# EAGLE design PDM_v1 (EAGLE 7.1.0)
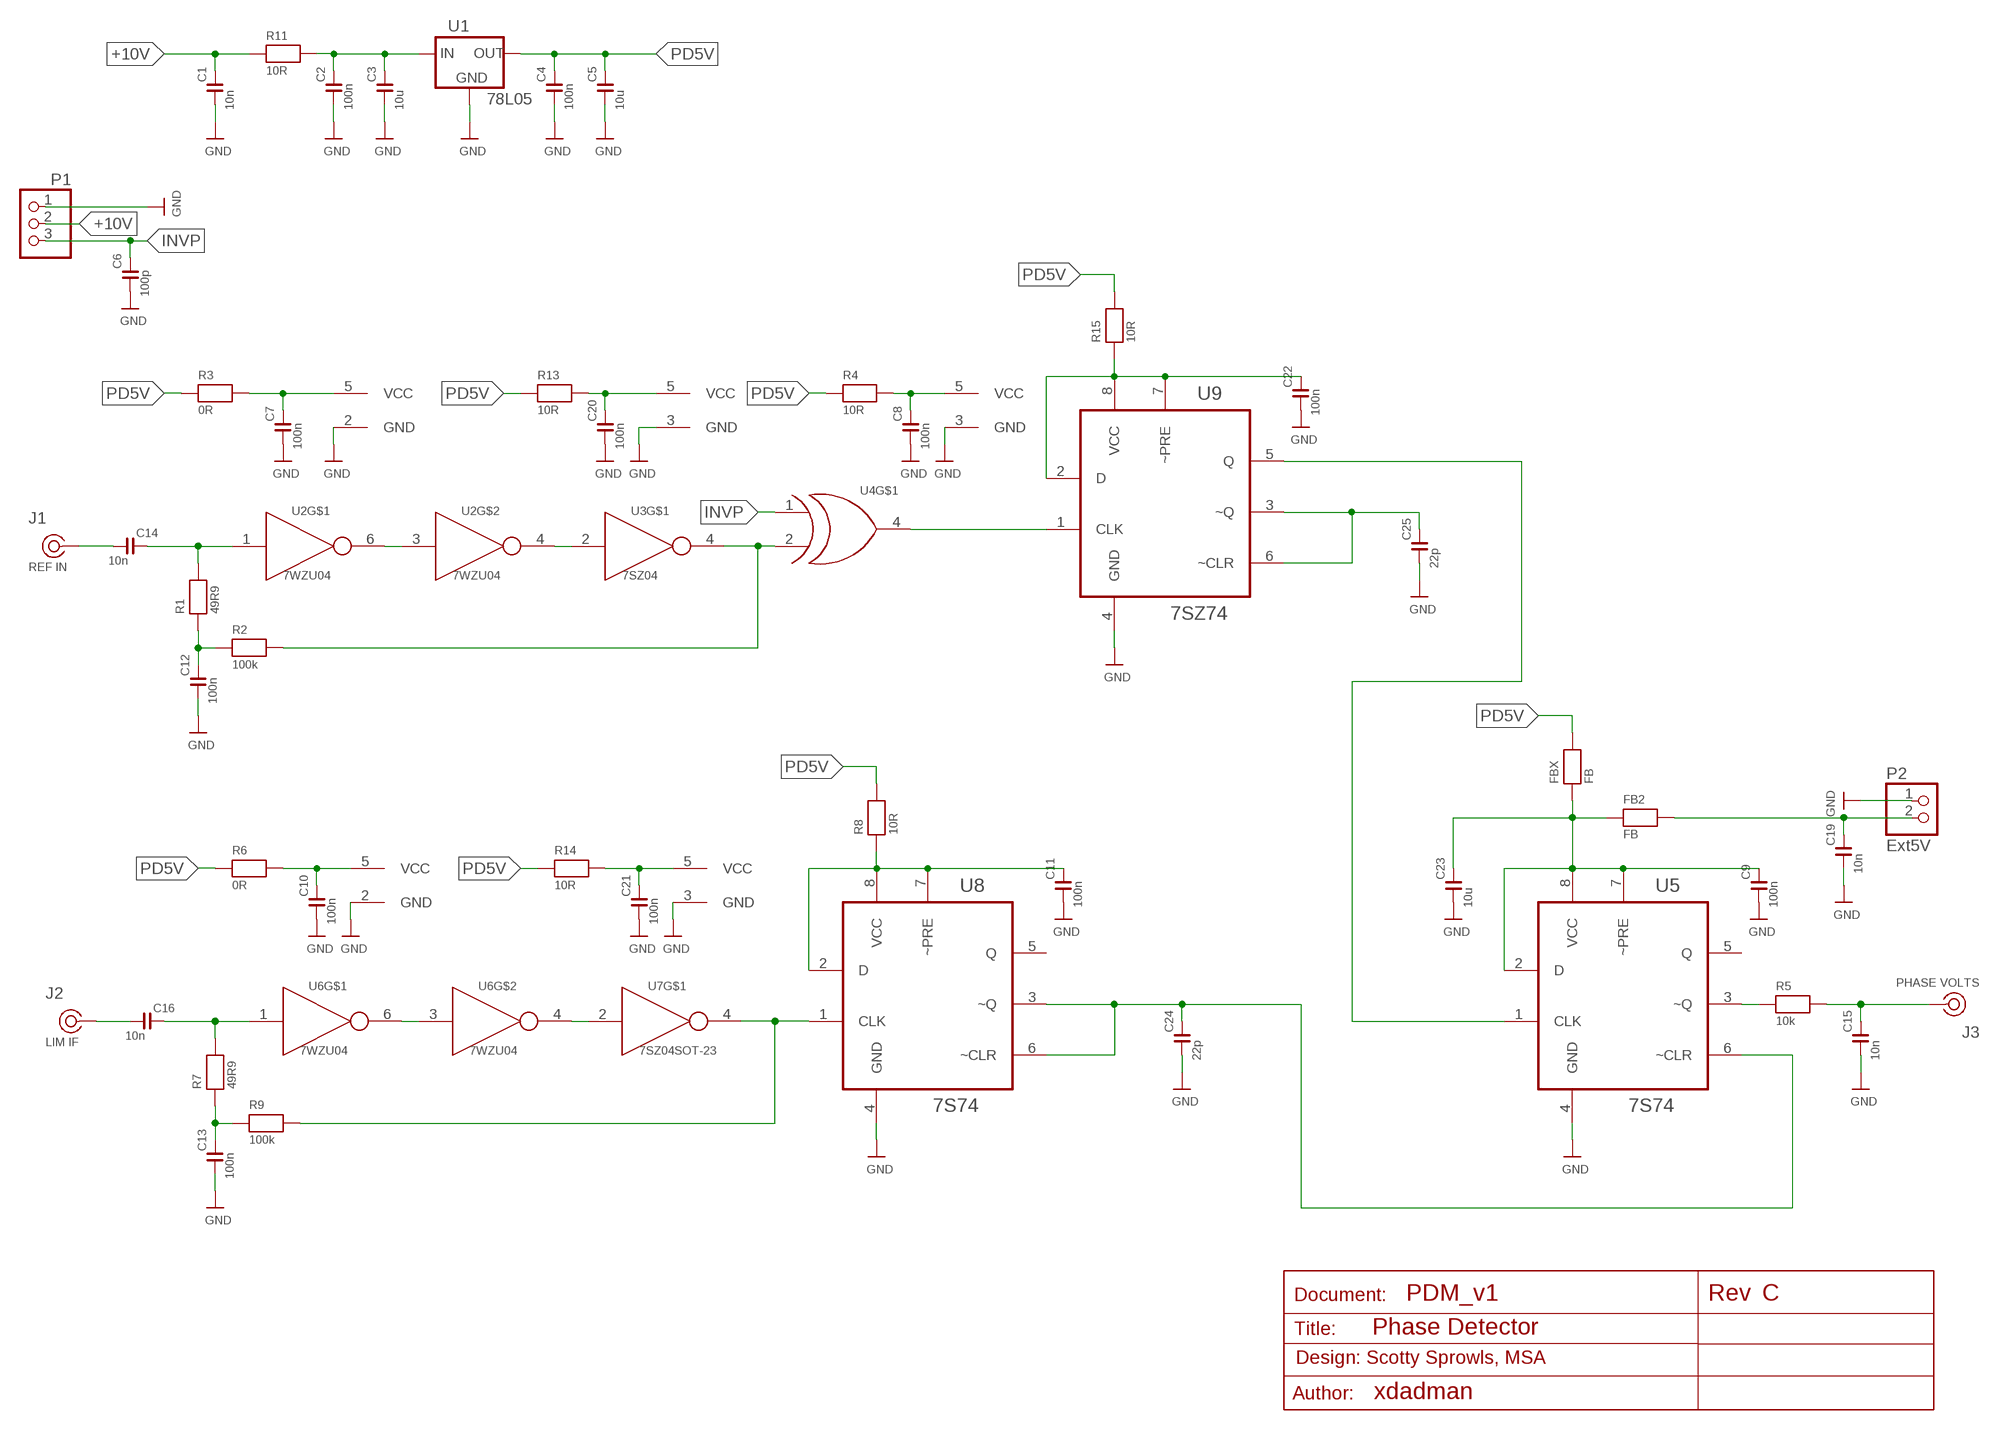
[diagram p0: schematic, sheet 1]

## Parts
C1  10n  C080510N  [C0805]
C2  100n  C0805100N  [C0805]
C3  10u  CC120610U  [C1206]
C4  100n  C0805100N  [C0805]
C5  10u  CC120610U  [C1206]
C6  100p  C0805100P  [C0805]
C7  100n  C0805100N  [C0805]
C8  100n  C0805100N  [C0805]
C9  100n  C0805100N  [C0805]
C10  100n  C0805100N  [C0805]
C11  100n  C0805100N  [C0805]
C12  100n  C0805100N  [C0805]
C13  100n  C0805100N  [C0805]
C14  10n  C080510N  [C0805]
C15  10n  C080510N  [C0805]
C16  10n  C080510N  [C0805]
C19  10n  C080510N  [C0805]
C20  100n  C0805100N  [C0805]
C21  100n  C0805100N  [C0805]
C22  100n  C0805100N  [C0805]
C23  10u  CC120610U  [C1206]
C24  22p  CC060322P  [C0603]
C25  22p  CC060322P  [C0603]
FB2  FB  R0805FB045  [R0805]
FBX  FB  R0805FB045  [R0805]
J1  REF IN  COAX  [SLIM_COAX_PAD]
J2  LIM IF  COAX  [SLIM_COAX_PAD]
J3  PHASE VOLTS  COAX  [SLIM_COAX_PAD]
P1  PINHD-1X3  [1X03]
P2  Ext5V  PINHD-1X2  [1X02]
R1  49R9  R080549R9  [R0805]
R2  100k  R0805100K  [R0805]
R3  0R  R08050R  [R0805]
R4  10R  R080510R  [R0805]
R5  10k  R080510K  [R0805]
R6  0R  R08050R  [R0805]
R7  49R9  R080549R9  [R0805]
R8  10R  R080510R  [R0805]
R9  100k  R0805100K  [R0805]
R11  10R  R080510R  [R0805]
R13  10R  R080510R  [R0805]
R14  10R  R080510R  [R0805]
R15  10R  R080510R  [R0805]
U1  78L05  78MXXL78L05  [SOT89]
U2  7WZU04  [SC70-6L]
U3  7SZ04  7SZ04SOT-23  [SOT23-5L]
U4  74LVC1G86  [SOT23-5L]
U5  7S74  SN74LVC2G74DCUR  [SOP50P310X90-8N]
U6  7WZU04  [SC70-6L]
U7  7SZ04SOT-23  [SOT23-5L]
U8  7S74  SN74LVC2G74DCUR  [SOP50P310X90-8N]
U9  7SZ74  SN74LVC2G74DCUR  [SOP50P310X90-8N]

## Nets
+10V: C1.2 P1.2 R11.1
GND: C1.1 C2.1 C3.1 C4.1 C5.1 C6.1 C7.1 C8.1 C9.1 C10.1 C11.1 C12.1 C13.1 C15.1 C19.1 C20.1 C21.1 C22.1 C23.1 C24.1 C25.1 P1.1 P2.1 U1.2(GND) U1.4(GND) U2.2(GND) U3.3(GND) U4.3(GND) U5.4(GND) U6.2(GND) U7.3(GND) U8.4(GND) U9.4(GND)
INVP: C6.2 P1.3 U4.1(A)
N$1: C2.2 C3.2 R11.2 U1.3(IN)
N$2: C14.2 R1.2 U2.1(IN)
N$3: C12.2 R1.1 R2.1
N$4: U2.3(IN) U2.6(OUT)
N$5: R2.2 U3.4(OUT) U4.2(B)
N$6: C20.2 R13.2 U3.5(VCC)
N$7: U2.4(OUT) U3.2(IN)
N$8: C8.2 R4.2 U4.5(VCC)
N$9: U4.4(Y) U9.1(CLK)
N$10: C22.2 R15.1 U9.2(D) U9.7(~PRE) U9.8(VCC)
N$11: C25.2 U9.3(~Q) U9.6(~CLR)
N$12: C16.2 R7.2 U6.1(IN)
N$13: C13.2 R7.1 R9.1
N$14: U6.3(IN) U6.6(OUT)
N$15: R9.2 U7.4(OUT) U8.1(CLK)
N$16: C21.2 R14.2 U7.5(VCC)
N$17: U6.4(OUT) U7.2(IN)
N$18: C10.2 R6.2 U6.5(VCC)
N$19: C11.2 R8.1 U8.2(D) U8.7(~PRE) U8.8(VCC)
N$20: C24.2 U5.6(~CLR) U8.3(~Q) U8.6(~CLR)
N$21: U5.1(CLK) U9.5(Q)
N$22: C9.2 C23.2 FB2.1 FBX.1 U5.2(D) U5.7(~PRE) U5.8(VCC)
N$23: C15.2 J3.SIG R5.2
N$24: C14.1 J1.SIG
N$25: C7.2 R3.2 U2.5(VCC)
N$26: C16.1 J2.SIG
N$27: R5.1 U5.3(~Q)
P2: C19.2 FB2.2 P2.2
PD5V: C4.2 C5.2 FBX.2 R3.1 R4.1 R6.1 R8.2 R13.1 R14.1 R15.2 U1.1(OUT)
Unconnected: U5.5(Q) U8.5(Q)

## Notes on the sheet
- C
- Phase Detector
- Design: Scotty Sprowls, MSA
- xdadman

## Power pins joined to a net without a drawn wire
GND: J1.GND J2.GND J3.GND

## Library data of the parts
C1 C14-C16 C19 = MSA_lib:C0805: Ceramic capacitor; OC_FARNELL: 1414662
C2 C4 C7-C13 C20-C22 = MSA_lib:C0805: Ceramic capacitor; OC_FARNELL: 1759166
C3 C5 C23 = MSA_lib:CC1206: Capacitor ceramic 1206; OC_FARNELL: 1611967
C6 = MSA_lib:C0805: Ceramic capacitor; OC_FARNELL: 1414656
C24 C25 = MSA_lib:CC0603: 0603 Ceramic capacitor; OC_FARNELL: 8819831
FB2 FBX = MSA_lib:R0805: Resistors; OC_FARNELL: 1515661
J1-J3 = MSA_lib:COAX
P1 = MSA_lib:PINHD-1X3: PIN HEADER
P2 = MSA_lib:PINHD-1X2: PIN HEADER
R1 R7 = MSA_lib:R0805: Resistors; OC_FARNELL: 2312274
R2 R9 = MSA_lib:R0805: Resistors; OC_FARNELL: 2332098
R3 R6 = MSA_lib:R0805: Resistors; OC_FARNELL: 2057661
R4 R8 R11 R13-R15 = MSA_lib:R0805: Resistors; OC_FARNELL: 2332043
R5 = MSA_lib:R0805: Resistors; OC_FARNELL: 2073607
U1 = MSA_lib:78MXXL: VOLTAGE REGULATOR; OC_FARNELL: 1366573
U2 U6 = MSA_lib:7WZU04; OC_FARNELL: 1467353
U3 U7 = MSA_lib:7SZ04; OC_FARNELL: 1417667
U4 = MSA_lib:74LVC1G86; OC_FARNELL: 1741239
U5 U8 U9 = MSA_lib:SN74LVC2G74DCUR: POSITIVE-EDGE-TRIGGERED D-FLIP-FLOP; MPN: SN74LVC2G74DCUR; OC_FARNELL: 1287633; OC_NEWARK: 76C4223; PACKAGE: VSSOP-8; SUPPLIER: Texas Instruments

## Net classes
1 50OHM: clearance 0.508 mm

## Board

Size 32 x 32 mm. Coordinates in mm from the lower left corner, seen from the top.
Outline: 0,0 32,0 32,32 0,32 0,0
Copper layers (1*16): Top 0.035mm / dielectric 1.5mm / Bottom 0.035mm
Design rules "kuba_no_CLR *": minimum track width 8mil, minimum drill 15mil, track to track 8mil, track to pad 8mil, pad to pad 8mil, via to via 8mil, smd to smd 8mil, copper to edge 0mil, drill to drill 8mil, minimum pad ring 12mil, minimum via ring 10mil, stop-mask expansion 4mil, vias tented up to drill 0mil, thermal gap 10mil

### Footprints (pad centres in the part's own frame; a part is rotated, then mirrored left to right if it is on the bottom)
C0805 = smd 1.2 x 1.5: 1 -0.953,0; 2 0.953,0
C1206 = smd 1.6 x 1.8: 1 -1.4,0; 2 1.4,0
C0603 = smd 0.9 x 1.1: 1 -0.794,0; 2 0.794,0
R0805 = smd 1.3 x 1.5: 1 -0.95,0; 2 0.95,0
SLIM_COAX_PAD = smd 1.27 x 0.635 bottom: GND 0,-2.667 | drill 1.1: SIG 0,0
1X03 = drill 1.016: 1 -2.54,0; 2 0,0; 3 2.54,0
1X02 = drill 1.016: 1 -1.27,0; 2 1.27,0
SOT89 = smd 1.2 x 1.5: 1 -1.6,-2; 3 1.6,-2 | smd 1 x 1.5: 2 0,-2 | smd 2.4 x 3: 4 0,1.25
SC70-6L = smd 0.35 x 0.8: 1 -0.65,-0.85; 2 0,-0.85; 3 0.65,-0.85; 4 0.65,0.85; 5 0,0.85; 6 -0.65,0.85
SOT23-5L = smd 0.55 x 1.2: 1 -0.95,-1.3; 2 0,-1.3; 3 0.95,-1.3; 4 0.95,1.3; 5 -0.95,1.3
SOP50P310X90-8N = smd 1.067 x 0.254: 1 -1.422,0.762; 2 -1.422,0.254; 3 -1.422,-0.254; 4 -1.422,-0.762; 5 1.422,-0.762; 6 1.422,-0.254; 7 1.422,0.254; 8 1.422,0.762

### Placement (x,y rotation side)
C1  19.56,14.48 270 top
C2  13.97,15.75 270 top
C3  11.94,14.73 270 top
C4  3.05,16.51 0 top
C5  3.56,18.54 0 top
C6  19.18,10.41 180 top
C7  10.67,7.87 0 top
C8  19.56,6.1 0 top
C9  21.08,20.57 90 top
C10  10.41,25.4 90 top
C11  20.57,28.19 180 top
C12  6.1,4.83 270 top
C13  12.95,21.59 270 top
C14  4.57,8.64 180 top
C15  25.4,17.53 270 top
C16  7.87,22.35 0 top
C19  28.45,28.7 180 top
C20  15.24,7.11 0 top
C21  16.51,27.18 0 top
C22  25.4,3.3 90 top
C23  27.94,22.86 180 top
C24  23.11,26.67 270 top
C25  27.69,3.3 90 top
FB2  24.89,25.65 90 top
FBX  19.3,20.57 270 top
J1  6.6,8.64 180 top
J2  6.86,23.62 180 top
J3  24.89,15.49 0 top
P1  17.27,12.95 270 top
P2  27.94,26.67 180 top
R1  4.06,5.59 90 top
R2  10.16,3.3 0 top
R3  10.67,9.65 0 top
R4  22.61,9.14 270 top
R5  23.62,17.53 270 top
R6  9.4,28.19 0 top
R7  11.18,21.59 90 top
R8  16.51,20.32 180 top
R9  16,22.1 0 top
R11  15.49,12.95 180 top
R13  14.48,9.65 0 top
R14  16.51,28.96 0 top
R15  24.38,11.43 90 top
U1  7.87,14.99 270 top
U2  9.4,5.59 270 top
U3  14.48,4.57 270 top
U4  19.81,3.56 270 top
U5  23.11,21.59 90 top
U6  12.7,24.89 0 top
U7  16.51,24.64 270 top
U8  20.07,25.15 90 top
U9  24.89,7.62 90 top

### Tracks (layer width: path | path; a pad name or v marks a point on that pad's centre or on a via)
+10V
  Top 0.813: R11.1 P1.2 18.99,12.95 C1.2
GND  (via drill 0.5)
  Top 0.305: 13.18,3.53 U3.3 12.77,3.62 12.7,3.56 v12.57,3.56 | v6.86,5.59 6.29,5.59 C12.1 | U1.2 v5.08,14.99 | C13.1 12.7,22.8 U6.2 12.7,23.11 v13.21,22.61 | C24.1 22.38,28.19 v22.1,28.19 C11.1 | C22.1 25.4,1.27 27.69,1.27 C25.1 | U4.3 17.46,2.61 v17.14,2.92 | U5.4 24.54,20.17 v24.64,20.07 25.4,19.3 C15.1 | C9.1 v21.08,18.8 | U8.4 20.83,23.37 v21.34,22.86 | U9.4 25.81,6.2 v26.16,5.84
  Top 0.406: U2.2 v6.86,5.59 | C8.1 18.61,6.79 v18.54,6.86 | C21.1 v14.99,27.18 | C10.1 9.72,24.45 v9.65,24.38 | U7.3 14.54,23.69 v14.48,23.62 | C20.1 v13.72,7.11 | C7.1 v9.14,7.87 | 0,2.29 2.03,2.29 2.03,1.78 v1.27,1.02
  Top 0.813: U1.4 v8.38,14.99 | C2.1 14.16,16.51 14.73,16.51 15.75,15.49 P1.1 19.49,15.49 C1.1 | C6.1 v20.83,10.41
  Top 1.016: v8.38,14.99 8.64,15.24 10.41,15.24 11.31,16.13 C3.1 12.07,16.26 12.07,16.39 12.32,16.39 12.7,16.76 | P2.1 30.23,26.67 | 12.7,16.76 13.97,16.76 | 12.7,16.76 12.45,16.76
  Bottom 0.305: v6.86,5.59 6.6,5.59 | 12.7,3.56 v12.57,3.56 | v13.21,22.61 12.95,22.61 | v22.1,28.19 21.84,28.19 | v24.64,20.07 24.64,19.81 | v17.14,2.92 17.27,2.92 | v21.08,18.8 21.08,19.3 | v21.34,22.86 21.08,22.86 | v26.16,5.84 26.16,6.1
  Bottom 0.406: v18.54,6.86 18.54,6.6 | v14.99,27.18 15.24,27.18 | v9.65,24.38 9.91,24.38 | v14.48,23.62 14.73,23.62 | v13.72,7.11 13.97,7.11 | v9.14,7.87 9.4,7.87 | v1.27,1.02 1.02,1.02
  Bottom 0.813: v8.38,14.99 8.64,14.99 | v20.83,10.41 20.57,10.41
  other vias: 1.02,4.57 1.02,9.14 1.02,13.72 1.02,17.78 1.02,22.1 1.02,26.42 1.02,30.99 4.83,30.99 8.38,30.99 11.94,30.99 15.49,30.99 19.56,30.99 23.62,30.99 27.94,30.99 30.73,30.99 30.99,28.19 30.99,24.89 30.99,21.08 30.99,17.27 30.99,13.97 30.99,10.92 30.99,7.87 30.99,4.32 30.99,1.02 26.92,1.02 22.35,1.02 17.78,1.02 12.95,1.02 9.4,1.02 5.59,1.02
  pour Top (no thermals): 0,2.38 0,32 32,32 32,0 0,0 0,2 30,2 30,30 2,30 2,2.38
  pour Bottom (no thermals): 0,0 32,0 32,32 0,32
INVP
  Top 0.406: U4.1 18.1,4.51 17.53,5.08 17.53,10.16 P1.3
  Top 0.813: C6.2 P1.3
N$1
  Top 0.305: 11.05,12.7 11.31,12.7 C3.2
  Top 0.813: U1.3 6.17,13.39 6.86,12.7 11.05,12.7 | 14.04,14.73 C2.2
  Top 1.016: C3.2 14.17,13.33 | 14.17,13.33 R11.2 | 14.04,14.73 14.04,13.46 14.17,13.33
N$2
  Top 0.305: R1.2 4.25,6.54 4.57,6.86 7.11,6.86 7.73,6.24 U2.1
  Top 0.61: C14.2 3.62,6.98 R1.2
N$3
  Top 0.61: R1.1 4.83,3.87 C12.2 6.67,3.3 R2.1
N$4
  Top 0.305: U2.3 9.26,4.94 9.4,5.08 9.4,5.84 9.79,6.24 U2.6
N$5
  Top 0.305: R2.2 11.18,3.3 11.94,2.54 14.22,2.54 15.24,3.56 15.71,3.56 U3.4 15.97,3.81 17.78,3.81 18.03,3.56 U4.2
N$6
  Top 0.406: U3.5 15.78,6.7 C20.2 16,7.3 16,8.89 15.43,9.46 R13.2
N$7
  Top 0.406: U2.4 11.83,4.94 12.19,4.57 U3.2
N$8
  Top 0.406: C8.2 20.51,5.91 21.08,5.33 21.08,4.54 U4.5
  Top 0.61: 20.64,6.23 C8.2
  Top 0.813: 20.64,6.23 R4.2
N$9
  Top 0.305: U9.1 24.13,5.08 21.84,2.79 21.3,2.79 U4.4
N$10
  Top 0.305: U9.8 24.13,10.48 R15.1 24.64,10.48 U9.7 U9.2 24.64,5.02 C22.2
N$11
  Top 0.305: U9.3 25.15,7.37 | 25.15,7.37 U9.6 | C25.2 27.69,6.35 26.67,7.37 25.15,7.37
N$12
  Top 0.305: U6.1 12.05,23.73 11.68,23.37 11.68,23.05 R7.2
  Top 1.016: C16.2 10.99,22.35 R7.2
N$13
  Top 0.406: R7.1 C13.2 13.27,20.64 13.97,21.34 14.29,21.34 R9.1
N$14
  Top 0.305: U6.6 12.05,25.03 12.19,24.89 12.95,24.89 13.35,24.5 U6.3
N$15
  Top 0.305: U8.1 17.85,23.72 U7.4
  Top 0.406: U7.4 17.59,23.69 17.02,23.11 17.02,22.16 R9.2
N$16
  Top 0.406: U7.5 17.81,26.83 C21.2 R14.2
N$17
  Top 0.305: U6.4 13.35,25.51 14.22,24.64 U7.2
N$18
  Top 0.305: U6.5 12.7,26.42 12.45,26.67 10.73,26.67 C10.2
  Top 0.406: R6.2 10.35,26.42 C10.2
N$19
  Top 0.305: U8.8 19.3,27.88 C11.2 19.81,28 U8.7 U8.2 19.81,22.86 19.56,22.61 18.29,22.61 18.03,22.35 18.03,20.89 R8.1
N$20
  Top 0.305: U8.6 20.32,25.15 | 20.32,25.15 U8.3 | U5.6 23.37,24.89 23.11,25.15 | 23.11,25.15 20.32,25.15 | C24.2 23.11,25.15
N$21
  Top 0.305: U5.1 22.35,14.48 23.37,13.46 25.3,13.46 25.65,13.1 U9.5
N$22
  Top 0.305: U5.2 22.86,21.53 U5.7 | U5.8 22.35,21.53
  Top 0.406: C9.2 FBX.1
  Top 0.813: C9.2 22.35,21.53 22.86,21.53 25.21,21.53 C23.2
  Top 1.016: FB2.1 24.89,24.51 C23.2
N$23
  Top 1.016: R5.2 23.81,16.58 24.51,15.88 | 24.51,15.88 J3.SIG | C15.2 25.21,16.57 24.51,15.88
N$24
  Top 1.27: C14.1 J1.SIG
N$25
  Top 0.406: U2.5 11.18,5.59 11.43,5.84 11.43,7.68 C7.2 R3.2
N$26
  Top 0.813: J2.SIG 6.86,22.42 C16.1
N$27
  Top 0.305: U5.3 23.37,18.73 R5.1
P2
  Top 1.016: FB2.2 24.96,26.67 P2.2 26.67,27.88 C19.2
PD5V
  Top 0.305: R8.2 15.49,20.32 14.73,19.56 5.08,19.56 4.83,19.3 4.83,19.05 | 4.83,19.05 4.83,18.67 C5.2 | FBX.2 19.12,19.62 18.54,19.05 4.83,19.05 | C5.2 19.56,18.54 21.84,16.26 21.84,14.22 23.43,12.63 24.13,12.63 R15.2 | R4.1 22.61,12.7 21.34,13.97 21.34,16 19.3,18.03 5.46,18.03 C5.2 | R13.1 13.53,10.09 12.7,10.92 9.4,10.92 8.64,11.68 5.08,11.68 4.06,12.7 4.06,16.45 C4.2 3.56,16.07 3.56,12.45 4.83,11.18 8.38,11.18 9.72,9.84 R3.1
  Top 0.406: R6.1 5.33,28.19 4.06,26.92 4.06,20.57 5.08,19.56 | R14.1 11.94,28.96 11.43,29.46 5.59,29.46 3.3,27.18 3.3,20.2 C5.2
  Top 0.813: C4.2 4.57,16.51 | 4.57,16.51 5.8,16.51 U1.1 | 5.46,18.03 4.83,18.03 4.57,18.29 4.57,16.51

### Text on the board
tPlace: R14 | FB2 | C19 | R6 | C10 | U6 | C21 | U8 | C11 | U7 | C24 | +5v | P2 | J2-LIM IF | C16 | U5 | C23 | C5 | R7 | C13 | R9 | R8 | U1 | C3 | FBX | C2 | G | P1 | C1 | C9 | C15 | C4 | R11 | R5 | J3 | PHASE VOLTS | J1-REF IN | R13 | C6 | R4 | C14 | R15 | R3 | PDM | C20 | C7 | C7 | C8 | U9 | U2 | C25 | U3 | R1 | R2 | U4 | C12 | C22